# Altium schematic sheet STM32WB.SchDoc
size A4; SheetNumber: 2; SheetTotal: 4
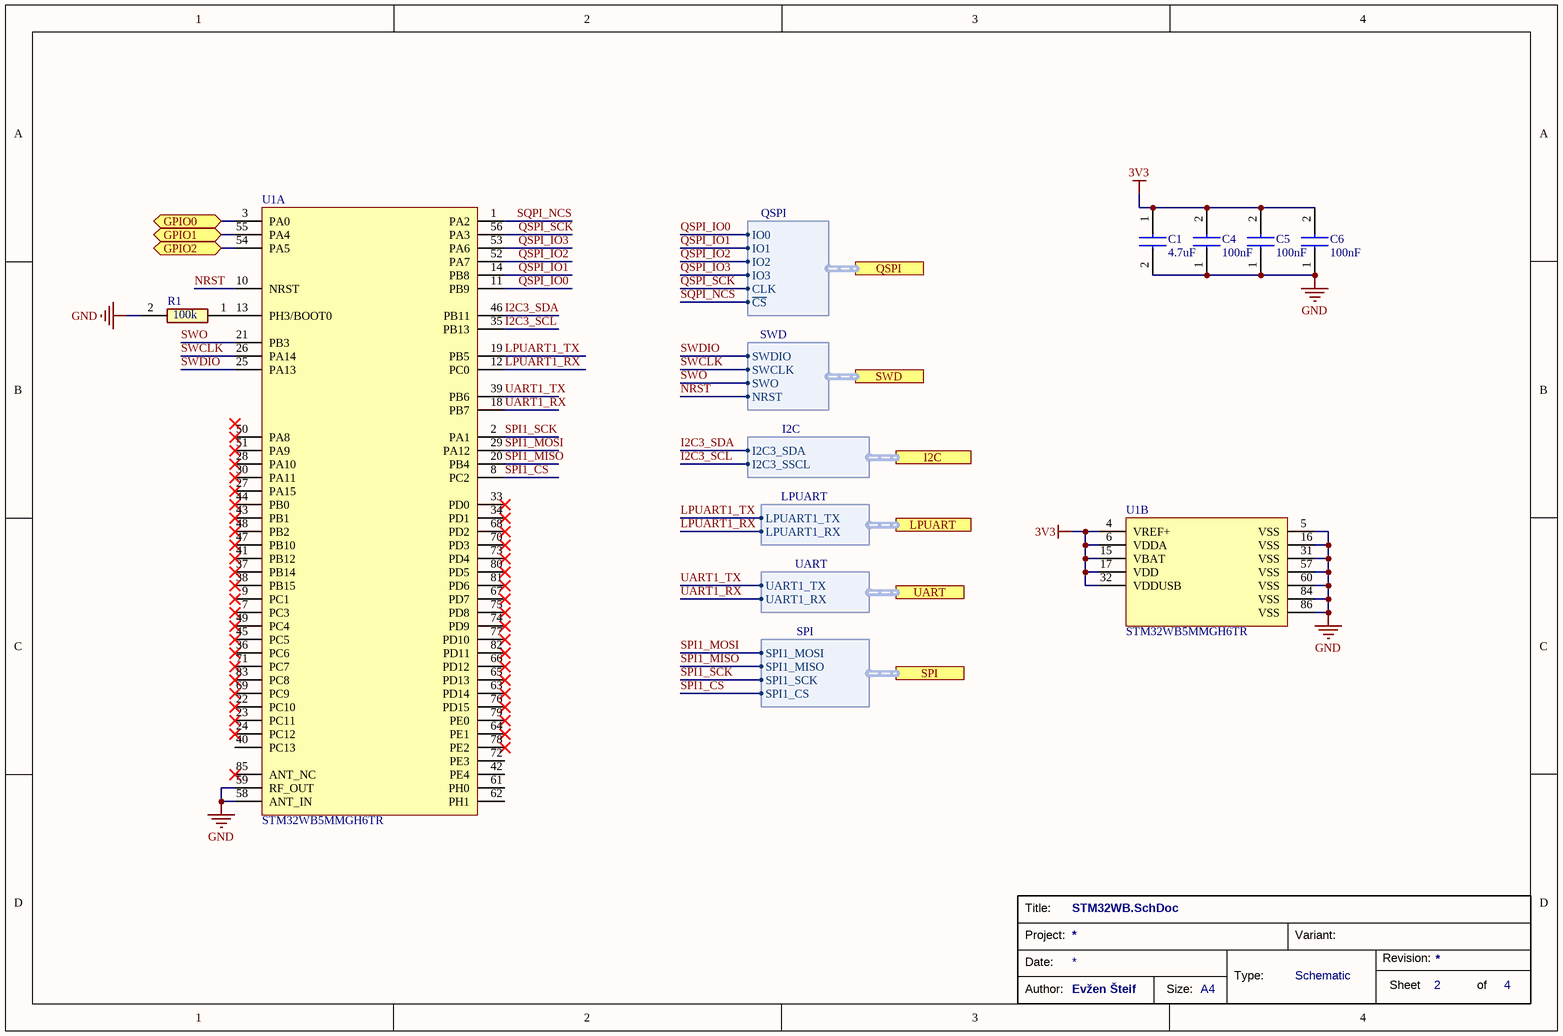
[diagram p0: STM32WB.SchDoc]

## Parts
C1  4.7uF  [CAPC1608X90N]
C4  100nF  [CAPC1005X70N]
C5  100nF  [CAPC1005X70N]
C6  100nF  [CAPC1005X70N]
R1  100k  [RESC1005X35N]
U1  STM32WB5MMGH6TR  [MOD_DORY_STM_86P_7P3X11_H1P342_Ref2]  (parts A,B of 2)

## Ports
GPIO0 (bidir, see main[2B]), GPIO1 (bidir, see main[2C]), GPIO2 (bidir, see main[2C]), I2C (harness I2C, see main[3C]), LPUART (harness LPUART, see main[3C]), QSPI (harness QSPI, see main[3D], Flash[1C]), SPI (harness SPI, see main[3C]), SWD (harness SWD, see main[2C]), UART (harness UART, see main[2C])

## Harnesses
SWD: SWDIO, SWCLK, SWO, NRST
QSPI: IO0, IO1, IO2, IO3, CLK, ~{CS}
I2C: I2C3_SDA, I2C3_SSCL
LPUART: LPUART1_TX, LPUART1_RX
UART: UART1_TX, UART1_RX
SPI: SPI1_MOSI, SPI1_MISO, SPI1_SCK, SPI1_CS

## Nets
3V3: C1.1 C4.2 C5.2 C6.2 U1.4(VREF+) U1.6(VDDA) U1.15(VBAT) U1.17(VDD) U1.32(VDDUSB)
GND: C1.2 C4.1 C5.1 C6.1 R1.2 U1.5(VSS) U1.16(VSS) U1.31(VSS) U1.57(VSS) U1.58(ANT_IN) U1.59(RF_OUT) U1.60(VSS) U1.84(VSS) U1.86(VSS)
GPIO0: U1.3(PA0) ; port GPIO0
GPIO1: U1.55(PA4) ; port GPIO1
GPIO2: U1.54(PA5) ; port GPIO2
I2C3_SCL: U1.35(PB13) ; port I2C.I2C3_SSCL
I2C3_SDA: U1.46(PB11) ; port I2C.I2C3_SDA
LPUART1_RX: U1.12(PC0) ; port LPUART.LPUART1_RX
LPUART1_TX: U1.19(PB5) ; port LPUART.LPUART1_TX
NRST: U1.10(NRST) ; port SWD.NRST
QSPI_IO0: U1.11(PB9) ; port QSPI.IO0
QSPI_IO1: U1.14(PB8) ; port QSPI.IO1
QSPI_IO2: U1.52(PA7) ; port QSPI.IO2
QSPI_IO3: U1.53(PA6) ; port QSPI.IO3
QSPI_SCK: U1.56(PA3) ; port QSPI.CLK
SPI1_CS: U1.8(PC2) ; port SPI.SPI1_CS
SPI1_MISO: U1.20(PB4) ; port SPI.SPI1_MISO
SPI1_MOSI: U1.29(PA12) ; port SPI.SPI1_MOSI
SPI1_SCK: U1.2(PA1) ; port SPI.SPI1_SCK
SQPI_NCS: U1.1(PA2) ; port QSPI.~{CS}
SWCLK: U1.26(PA14) ; port SWD.SWCLK
SWDIO: U1.25(PA13) ; port SWD.SWDIO
SWO: U1.21(PB3) ; port SWD.SWO
UART1_RX: U1.18(PB7) ; port UART.UART1_RX
UART1_TX: U1.39(PB6) ; port UART.UART1_TX
NetR1_1: R1.1 U1.13(PH3/BOOT0)

Not connected (* = marked no-connect by the designer): U1 7(PC3)* 9(PC1)* 22(PC10)* 23(PC11)* 24(PC12)* 27(PA15)* 28(PA10)* 30(PA11)* 33(PD0)* 34(PD1)* 36(PC6)* 37(PB14)* 38(PB15)* 40(PC13) 41(PB12)* 42(PE4) 43(PB1)* 44(PB0)* 45(PC5)* 47(PB10)* 48(PB2)* 49(PC4)* 50(PA8)* 51(PA9)* 61(PH0) 62(PH1) 63(PD14)* 64(PE1)* 65(PD13)* 66(PD12)* 67(PD7)* 68(PD2)* 69(PC9)* 70(PD3)* 71(PC7)* 72(PE3) 73(PD4)* 74(PD9)* 75(PD8)* 76(PD15)* 77(PD10)* 78(PE2)* 79(PE0)* 80(PD5)* 81(PD6)* 82(PD11)* 83(PC8)* 85(ANT_NC)*

## Notes on the sheet
- Title:
- Date:
- Project:
- Type:
- Schematic
- Variant:
- Revision:
- Sheet
- of
- Author:
- Evžen Šteif
- Size:
- A4

## Library data of the parts
C1 = GRM188R61E475KE11J: Capacitor; Manufacturer_Name: Murata Electronics; Datasheet Link: https://search.murata.co.jp/Ceramy/image/img/A01X/G101/ENG/GRM188R61E475KE11-01A.pdf; Height: 0.9mm; Manufacturer_Part_Number: GRM188R61E475KE11J; Mouser Part Number: 81-GRM188R61E475KE1J; Mouser Price/Stock: https://www.mouser.co.uk/ProductDetail/Murata-Electronics/GRM188R61E475KE11J?qs=hNud%2FORuBR3%2Fa9GLJFT8KA%3D%3D; Arrow Part Number: GRM188R61E475KE11J; Arrow Price/Stock: https://www.arrow.com/en/products/grm188r61e475ke11j/murata-manufacturing
C4-C6 = GRM155R61A104KA01D: Capacitor; Manufacturer_Name: Murata Electronics; Datasheet Link: https://search.murata.co.jp/Ceramy/image/img/A01X/G101/ENG/GRM155R61A104KA01-02A.pdf; Height: 0.7mm; Manufacturer_Part_Number: GRM155R61A104KA01D; Mouser Part Number: 81-GRM155R61A104KA01; Mouser Price/Stock: https://www.mouser.co.uk/ProductDetail/Murata-Electronics/GRM155R61A104KA01D?qs=5bAuhL3RhmNZw0v59AqOJA%3D%3D; Arrow Part Number: GRM155R61A104KA01D; Arrow Price/Stock: https://www.arrow.com/en/products/grm155r61a104ka01d/murata-manufacturing?utm_currency=USD&region=europe
R1 = RT0402FRE07100KL: Resistor; Manufacturer_Name: KEMET; Datasheet Link: https://www.yageo.com/upload/media/product/productsearch/datasheet/rchip/PYu-RT_1-to-0.01_RoHS_L_11.pdf; Height: 0.35mm; Manufacturer_Part_Number: RT0402FRE07100KL; Mouser Part Number: 603-RT0402FRE07100KL; Mouser Price/Stock: https://www.mouser.co.uk/ProductDetail/YAGEO/RT0402FRE07100KL?qs=BXCcY9r%252B08CxTvf5JB1kiw%3D%3D; Arrow Part Number: RT0402FRE07100KL; Arrow Price/Stock: https://www.arrow.com/en/products/rt0402fre07100kl/yageo
U1 = STM32WB5MMGH6TR: MCU module, LGA-86, Cortex-M4, 64 MHz, 1 MB Flash, 256 kB RAM, BLE 5.4, 802.15.4; Manufacturer: STMicroelectronics; Part Name: STM32WB5MMGH6TR; Supplier: Mouser; Supplier Part Number: 511-STM32WB5MMGH6TR; Manufacturer Part Number: STM32WB5MMGH6TR; Category: MCUs; Case/Package: LGA-86; Min Operating Temperature: -40°C; Max Operating Temperature: 85°C; Datasheet: https://www.st.com/resource/en/datasheet/stm32wb5mmg.pdf